# Altium schematic sheet AFE_ADS1298.SchDoc
size A4
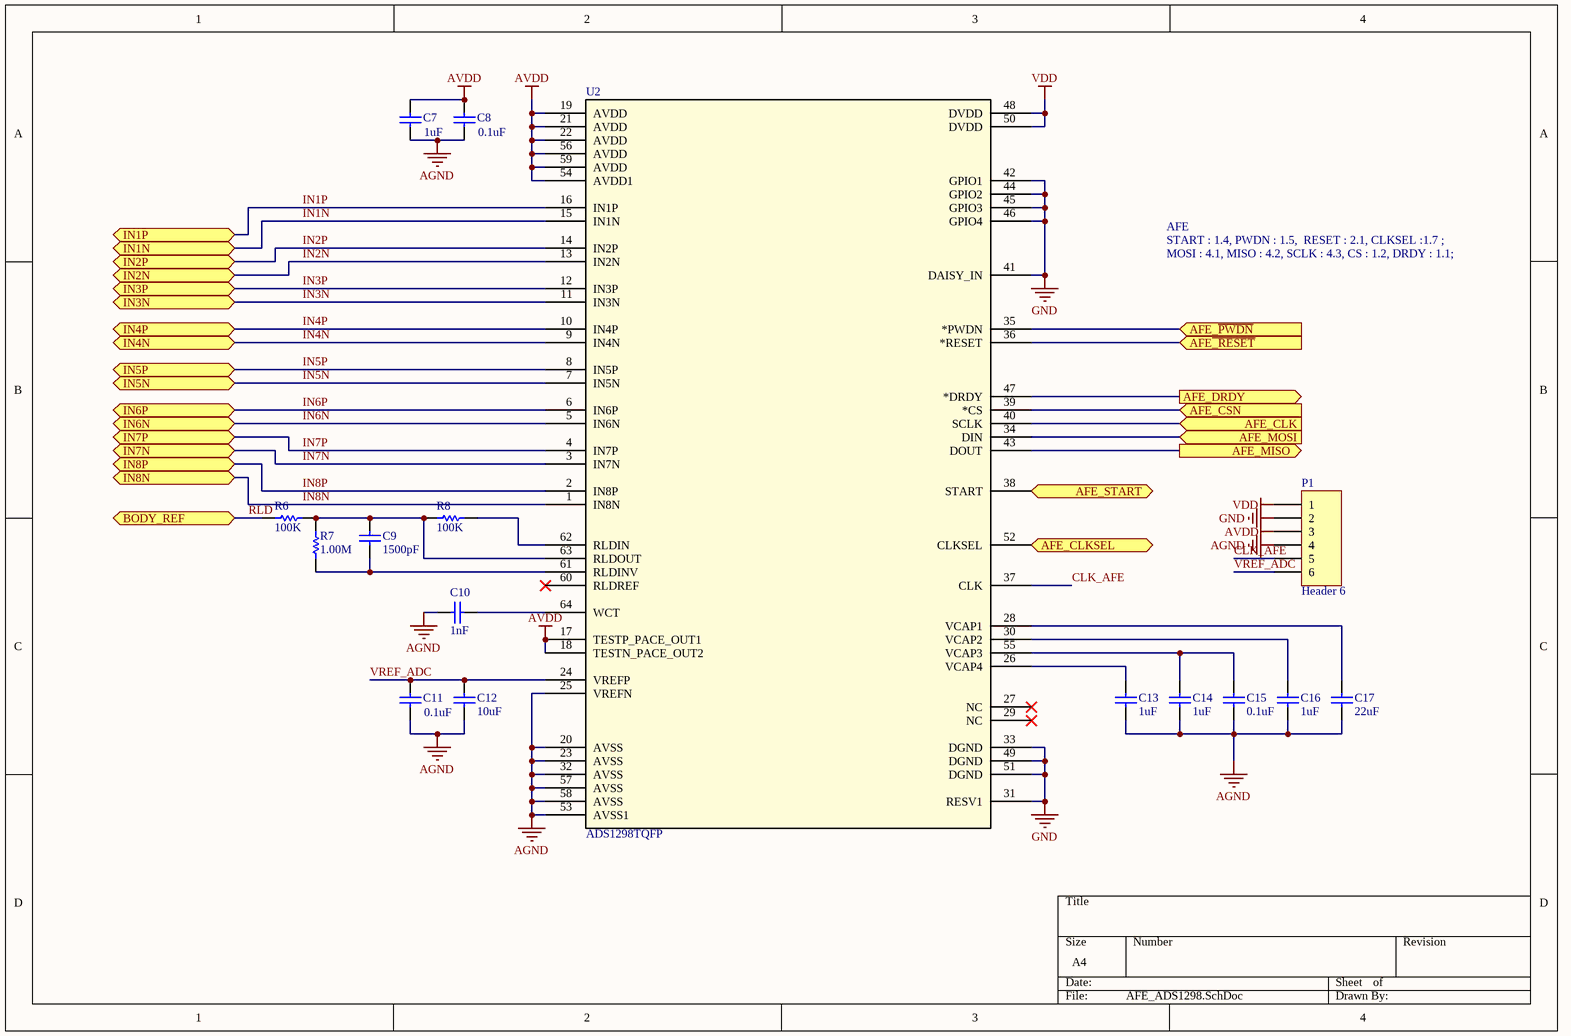
[diagram p0: AFE_ADS1298.SchDoc]

## Parts
C7  value 1uF  [0402]  (hidden comment: Cap)
C8  value 0.1uF  [0402]  (hidden comment: Cap)
C9  value 1500pF  [0402]  (hidden comment: Cap)
C10  value 1nF  [0402]  (hidden comment: Cap)
C11  value 0.1uF  [0402]  (hidden comment: Cap)
C12  value 10uF  [0402]
C13  value 1uF  [0402]  (hidden comment: Cap)
C14  value 1uF  [0402]  (hidden comment: Cap)
C15  value 0.1uF  [0402]  (hidden comment: Cap)
C16  value 1uF  [0402]  (hidden comment: Cap)
C17  value 22uF  [0402]  (hidden comment: Cap)
P1  Header 6  [HDR1X6]
R6  value 100K  [0402]  (hidden comment: Res1)
R7  value 1.00M  [0402]  (hidden comment: Res1)
R8  value 100K  [0402]  (hidden comment: Res1)
U2  ADS1298TQFP  [64TQFP]

## Ports
AFE_CLK (in), AFE_CLKSEL (in), AFE_CSN (in), AFE_DRDY (out), AFE_MISO (out), AFE_MOSI (in), AFE_START (in), AFE_~{PWDN} (in), AFE~{_RESET} (in), BODY_REF (bidir), IN1N (bidir), IN1P (bidir), IN2N (bidir), IN2P (bidir), IN3N (bidir), IN3P (bidir), IN4N (bidir), IN4P (bidir), IN5N (bidir), IN5P (bidir), IN6N (bidir), IN6P (bidir), IN7N (bidir), IN7P (bidir), IN8N (bidir), IN8P (bidir)

## Nets
AGND: C7.1 C8.1 C10.2 C11.1 C12.1 C13.2 C14.2 C15.2 C16.2 C17.2 P1.4 U2.20(AVSS) U2.23(AVSS) U2.25(VREFN) U2.32(AVSS) U2.53(AVSS1) U2.57(AVSS) U2.58(AVSS)
AVDD: C7.2 C8.2 P1.3 U2.17(TESTP_PACE_OUT1) U2.18(TESTN_PACE_OUT2) U2.19(AVDD) U2.21(AVDD) U2.22(AVDD) U2.54(AVDD1) U2.56(AVDD) U2.59(AVDD)
GND: P1.2 U2.31(RESV1) U2.33(DGND) U2.41(DAISY_IN) U2.42(GPIO1) U2.44(GPIO2) U2.45(GPIO3) U2.46(GPIO4) U2.49(DGND) U2.51(DGND)
VDD: P1.1 U2.48(DVDD) U2.50(DVDD)
AFE~{_RESET}: U2.36(*RESET) ; port AFE~{_RESET}
AFE_CLK: U2.40(SCLK) ; port AFE_CLK
AFE_CLKSEL: U2.52(CLKSEL) ; port AFE_CLKSEL
AFE_CSN: U2.39(*CS) ; port AFE_CSN
AFE_DRDY: U2.47(*DRDY) ; port AFE_DRDY
AFE_MISO: U2.43(DOUT) ; port AFE_MISO
AFE_MOSI: U2.34(DIN) ; port AFE_MOSI
AFE_~{PWDN}: U2.35(*PWDN) ; port AFE_~{PWDN}
AFE_START: U2.38(START) ; port AFE_START
CLK_AFE: P1.5 U2.37(CLK)
IN1N: U2.15(IN1N) ; port IN1N
IN1P: U2.16(IN1P) ; port IN1P
IN2N: U2.13(IN2N) ; port IN2N
IN2P: U2.14(IN2P) ; port IN2P
IN3N: U2.11(IN3N) ; port IN3N
IN3P: U2.12(IN3P) ; port IN3P
IN4N: U2.9(IN4N) ; port IN4N
IN4P: U2.10(IN4P) ; port IN4P
IN5N: U2.7(IN5N) ; port IN5N
IN5P: U2.8(IN5P) ; port IN5P
IN6N: U2.5(IN6N) ; port IN6N
IN6P: U2.6(IN6P) ; port IN6P
IN7N: U2.3(IN7N) ; port IN7N
IN7P: U2.4(IN7P) ; port IN7P
IN8N: U2.1(IN8N) ; port IN8N
IN8P: U2.2(IN8P) ; port IN8P
RLD: R6.2 ; port BODY_REF
VREF_ADC: C11.2 C12.2 P1.6 U2.24(VREFP)
NetC9_1: C9.1 R7.2 U2.61(RLDINV)
NetC9_2: C9.2 R6.1 R7.1 R8.2 U2.63(RLDOUT)
NetC10_1: C10.1 U2.64(WCT)
NetC13_1: C13.1 U2.26(VCAP4)
NetC14_1: C14.1 C15.1 U2.55(VCAP3)
NetC16_1: C16.1 U2.30(VCAP2)
NetC17_1: C17.1 U2.28(VCAP1)
NetR8_1: R8.1 U2.62(RLDIN)

Not connected (* = marked no-connect by the designer): U2 27(NC)* 29(NC)* 60(RLDREF)*

## Notes on the sheet
- AFE
- START : 1.4, PWDN : 1.5,  RESET : 2.1, CLKSEL :1.7 ;
- MOSI : 4.1, MISO : 4.2, SCLK : 4.3, CS : 1.2, DRDY : 1.1;

## Library data of the parts
C7-C11 C13-C17 = Cap: Capacitor
C12 = Cap Semi: Capacitor (Semiconductor SIM Model)
P1 = Header 6: Header, 6-Pin; LatestRevisionDate: 17-Jul-2002; LatestRevisionNote: Re-released for DXP Platform.; Publisher: Altium Limited
R6-R8 = Res1: Resistor
U2 = ADS1298_PAG_64: Imported; Manufacturer: Texas Instruments; INDUSTRY_STD_PKG_TYPE: TQFP; FAMILY_NAME: ECG / EEG Analog Front End; PIN_COUNT: 64; PACKAGE_DESIGNATOR: PAG; Datasheet URL: http://www.ti.com/lit/gpn/ADS1298; GENERIC_PART_NUMBER: ADS1298; RefDes: RefDes; Type: DEV; Value: Value